# Altium schematic sheet RobotSomatic.SchDoc
size A4
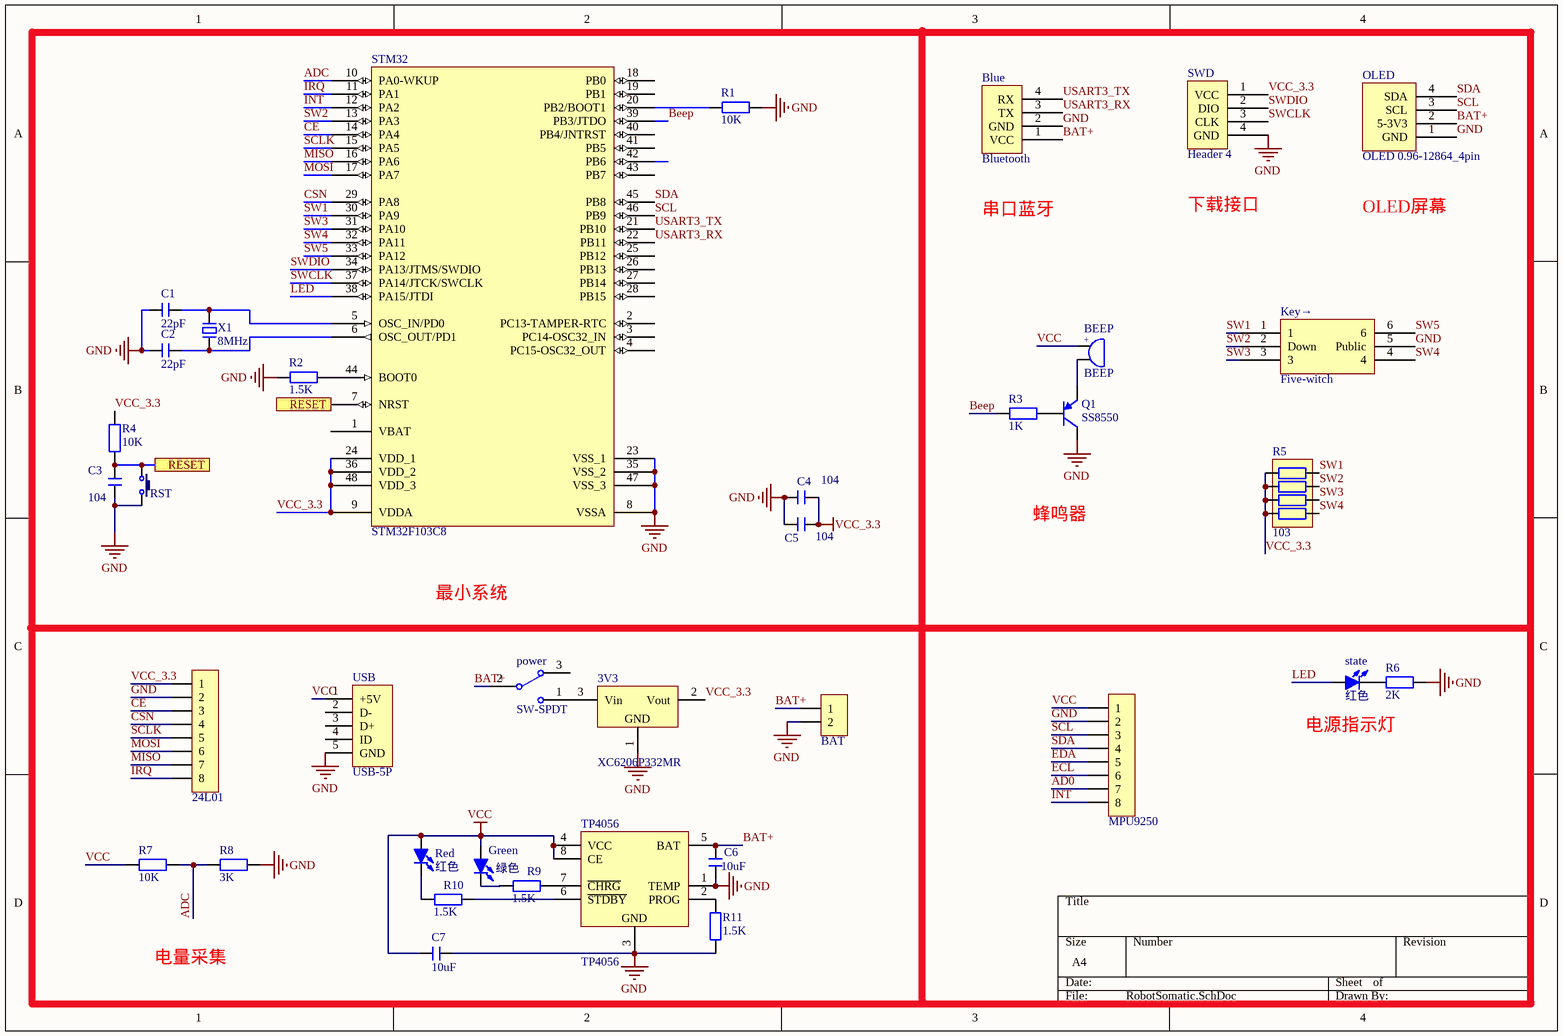
[diagram p0: RobotSomatic.SchDoc]

## Parts
3V3  XC6206P332MR  [SOT23-3L]
24L01  HDR-1X8  [pad*8]  (value not drawn)
BAT  HDR-1X2  [HDR-1X2]  (value not drawn)
BEEP  BEEP  [BEEP 5x9x5.5]
Blue  Bluetooth  [HDR-1X4_M]
C1  22pF  [C 0603]
C2  22pF  [C 0603]
C3  104  [C 0603]
C4  104  [C 0603]
C5  104  [C 0603]
C6  10uF  [C 0603]
C7  10uF  [C 0603]
Green  绿色  [LED 0603G]
Key→  Five-witch  [Five-witch]
MPU9250  HDR-1X8  [HDR2.54-M-LI-8P]  (value not drawn)
OLED  OLED 0.96-12864_4pin  [OLED 0.96-12864_4pin]
power  SW-SPDT  [KEY_HDR3]
Q1  SS8550  [TO92A]
R1  10K  [R 0603]
R2  1.5K  [R 0603]
R3  1K  [R 0603]
R4  10K  [R 0603]
R5  103  [RCA-8P4R-0603]
R6  2K  [R 0603]
R7  10K  [R 0603]
R8  3K  [R 0603]
R9  1.5K  [R 0603]
R10  1.5K  [R 0603]
R11  1.5K  [R 0603]
Red  红色  [LED 0603R]
RST  3x6x5  [TSW SMD-3*6*2.5]  (value not drawn)
state  红色  [LED 0603R]
STM32  STM32F103C8  [LQFP48 7X7_N]
SWD  Header 4  [HDR-1X4]
TP4056  TP4056  [SOP8_N]
USB  USB-5P  [USB-MICRO_A]
X1  8MHz  [XTAL-49S DIP]

## Ports
RESET

## Nets
GND: 3V3.1(GND) 24L01.2 BAT.2 Blue.2(GND) C1.2 C2.2 C3.1 C4.1 C5.1 C6.1 C7.2 Key→.5(Public) MPU9250.2 OLED.1(GND) Q1.3(C) R1.2 R2.1 R6.2 R8.2 R11.1 RST.2 STM32.8(VSSA) STM32.23(VSS_1) STM32.35(VSS_2) STM32.47(VSS_3) SWD.4(GND) TP4056.1(TEMP) TP4056.3(GND) USB.5(GND)
VCC: BEEP.1 C7.1 Green.1(A) MPU9250.1 R7.1 Red.1(A) TP4056.4(VCC) TP4056.8(CE) USB.1(+5V)
VCC_3.3: 3V3.2(Vout) 24L01.1 C4.2 C5.2 R4.2 R5.1 R5.2 R5.3 R5.4 STM32.9(VDDA) STM32.24(VDD_1) STM32.36(VDD_2) STM32.48(VDD_3) SWD.1(VCC)
AD0: MPU9250.7
ADC: R7.2 R8.1 STM32.10(PA0-WKUP)
BAT+: BAT.1 Blue.1(VCC) C6.2 OLED.2(5-3V3) power.2 TP4056.5(BAT)
Beep: R3.1 STM32.39(PB3/JTDO)
CE: 24L01.3 STM32.14(PA4)
CSN: 24L01.4 STM32.29(PA8)
ECL: MPU9250.6
EDA: MPU9250.5
INT: MPU9250.8 STM32.12(PA2)
IRQ: 24L01.8 STM32.11(PA1)
LED: state.1(A) STM32.38(PA15/JTDI)
MISO: 24L01.7 STM32.16(PA6)
MOSI: 24L01.6 STM32.17(PA7)
RESET: C3.2 R4.1 RST.1 STM32.7(NRST) ; port RESET
SCL: MPU9250.3 OLED.3(SCL) STM32.46(PB9)
SCLK: 24L01.5 STM32.15(PA5)
SDA: MPU9250.4 OLED.4(SDA) STM32.45(PB8)
SW1: Key→.1 R5.8 STM32.30(PA9)
SW2: Key→.2(Down) R5.7 STM32.13(PA3)
SW3: Key→.3 R5.6 STM32.31(PA10)
SW4: Key→.4 R5.5 STM32.32(PA11)
SW5: Key→.6 STM32.33(PA12)
SWCLK: STM32.37(PA14/JTCK/SWCLK) SWD.3(CLK)
SWDIO: STM32.34(PA13/JTMS/SWDIO) SWD.2(DIO)
USART3_RX: Blue.3(TX) STM32.22(PB11)
USART3_TX: Blue.4(RX) STM32.21(PB10)
Net3V3_3: 3V3.3(Vin) power.1
NetBEEP_2: BEEP.2 Q1.1(E)
NetC1_1: C1.1 STM32.5(OSC_IN/PD0) X1.2
NetC2_1: C2.1 STM32.6(OSC_OUT/PD1) X1.1
NetGreen_2: Green.2(K) R9.2
NetQ1_2: Q1.2(B) R3.2
NetR1_1: R1.1 STM32.20(PB2/BOOT1)
NetR2_2: R2.2 STM32.44(BOOT0)
NetR6_1: R6.1 state.2(K)
NetR9_1: R9.1 TP4056.7(~{CHRG})
NetR10_1: R10.1 Red.2(K)
NetR10_2: R10.2 TP4056.6(~{STDBY})
NetR11_2: R11.2 TP4056.2(PROG)

Not connected (* = marked no-connect by the designer): power 3; STM32 1(VBAT) 2(PC13-TAMPER-RTC) 3(PC14-OSC32_IN) 4(PC15-OSC32_OUT) 18(PB0) 19(PB1) 25(PB12) 26(PB13) 27(PB14) 28(PB15) 40(PB4/JNTRST) 41(PB5) 42(PB6) 43(PB7); USB 2(D-) 3(D+) 4(ID)

## Notes on the sheet
- 串口蓝牙
- 下载接口
- OLED屏幕
- 蜂鸣器
- 最小系统
- 电源指示灯
- 电量采集
- (in symbol BEEP) +

## Library data of the parts
3V3 = XC6206P332MR: 3V3三端稳压芯片; BOM名称: 稳压芯片; 版权归属: 源创客; 学习资源: www.ooocke.com
24L01 MPU9250 = Header 8: 8P接插件; 版权归属: 源创客; BOM名称: 8P接插件; 学习资源: www.ooocke.com
BAT = Header 2: 2P接插件; 版权归属: 源创客; BOM名称: 2P接插件; 学习资源: www.ooocke.com
BEEP = BEEP: 蜂鸣器; 版权归属: 源创客; BOM名称: 蜂鸣器; 学习资源: www.ooocke.com
Blue = Header4booth: 蓝牙/串口
C1-C7 = C: 无极性贴片电容; 版权归属: 源创客; BOM名称: 无极性贴片电容; 学习资源: www.ooocke.com
Green Red state = LED-SMD: 贴片LED; 版权归属: 源创客; BOM名称: 贴片LED; 学习资源: www.ooocke.com
Key→ = Five-witch: 五向开关
OLED = OLED 0.96-12864_4pin: 12864 点阵屏
power = SW-SPDT: 开关; Published: 24-Mar-1999; LatestRevisionDate: 17-Dec-2003; LatestRevisionNote: Schematic revised, PCB Footprint replaced.; DatasheetDocument: 05-Dec-2000; PackageReference: TL36WW15050; Publisher: Altium Limited; ComponentLink1Description: Manufacturer Link; ComponentLink1URL: http://www.apem.com
Q1 = 8550-DIP: 高频放大-PNP型; 版权归属: 源创客; 属性: 40V 1.5A 1W 100MHZ; BOM名称: 高频放大-PNP型; 学习资源: www.ooocke.com
R1-R4 R6-R11 = R: 贴片电阻; 版权归属: 源创客; BOM名称: 贴片电阻; 学习资源: www.ooocke.com
R5 = R-8P4R: 贴片网络排阻; 版权归属: 源创客; BOM名称: 贴片网络排阻; 学习资源: www.ooocke.com
RST = TSW 3x6: 3x6轻触开关; 版权归属: 源创客; BOM名称: 3x6轻触开关; 学习资源: www.ooocke.com
STM32 = STM32F103C8: Flaah:64/RAM:20/IO:36; BOM名称: 32位STM单片机; 版权归属: 源创客; 学习资源: www.ooocke.com
SWD = Header 4: SWD; LatestRevisionDate: 17-Jul-2002; LatestRevisionNote: Re-released for DXP Platform.; Publisher: Altium Limited
TP4056 = TP4056: 锂电池充电管理; 版权归属: 源创客; BOM名称: 锂电池充电管理; 学习资源: www.ooocke.com
USB = USB-5P: 微型USB母座; 版权归属: 源创客; BOM名称: 微型USB母座; 学习资源: www.ooocke.com
X1 = XTAL-2: 2脚晶振; 版权归属: 源创客; BOM名称: 2脚晶振; 学习资源: www.ooocke.com